# EAGLE design Adafruit Feather STM32F405 Express (EAGLE 9.5.0)
COMPANY: ADAFRUIT INDUSTRIES; DRAWN: KTOWN; REV: B
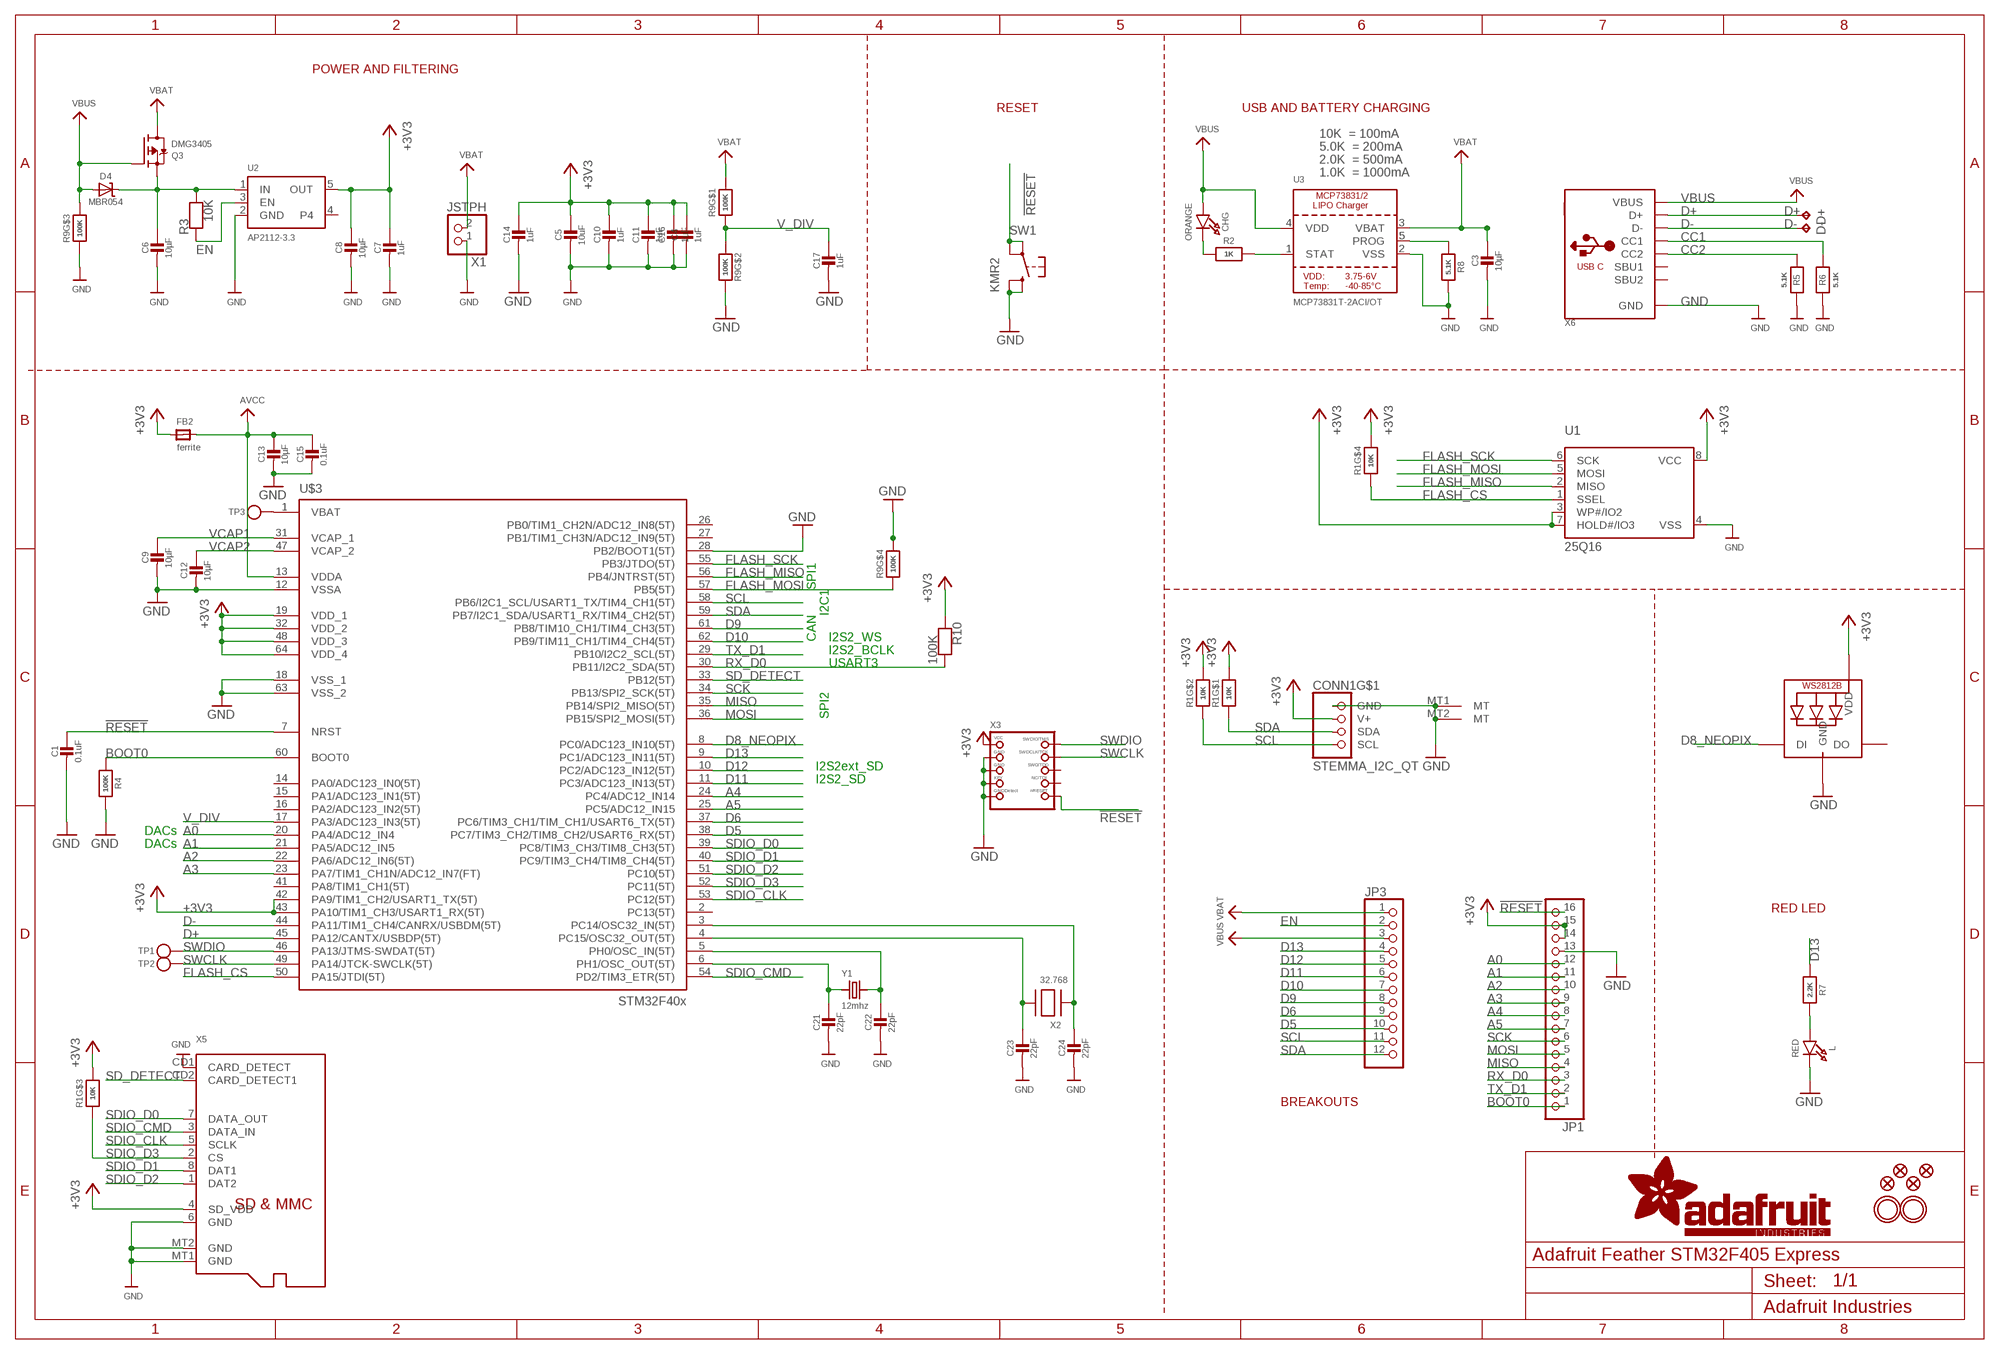
[diagram p0: schematic, sheet 1]

## Parts
C1  0.1uF  CAP_CERAMIC0603_NO  [0603-NO]
C2  22pF  CAP_4PACK1206  [RESPACK_4X0603]
C3  10µF  CAP_CERAMIC0805-NOOUTLINE  [0805-NO]
C4  1uF  CAP_CERAMIC0603_NO  [0603-NO]
C5  10uF  CAP_CERAMIC0805-NOOUTLINE  [0805-NO]
C6  10µF  CAP_CERAMIC0805-NOOUTLINE  [0805-NO]
C7  1uF  CAP_CERAMIC0603_NO  [0603-NO]
C8  10µF  CAP_CERAMIC0805-NOOUTLINE  [0805-NO]
C9  10µF  CAP_CERAMIC0805-NOOUTLINE  [0805-NO]
C10  1uF  CAP_CERAMIC0603_NO  [0603-NO]
C11  1uF  CAP_CERAMIC0603_NO  [0603-NO]
C12  10µF  CAP_CERAMIC0805-NOOUTLINE  [0805-NO]
C13  10µF  CAP_CERAMIC0805-NOOUTLINE  [0805-NO]
C14  1uF  CAP_CERAMIC0603_NO  [0603-NO]
C15  0.1uF  CAP_CERAMIC0603_NO  [0603-NO]
C16  1uF  CAP_CERAMIC0603_NO  [0603-NO]
C17  1uF  CAP_CERAMIC0603_NO  [0603-NO]
CHG  ORANGE  LED0805_NOOUTLINE  [CHIPLED_0805_NOOUTLINE]
CONN1  STEMMA_I2C_QT  [JST_SH4]
D4  MBR054  DIODE-SCHOTTKYSOD-123  [SOD-123]
D+  TPB1,27  [B1,27]
D-  TPB1,27  [B1,27]
FB2  ferrite  FERRITE-0805NO  [0805-NO]
JP1  HEADER-1X16ROUND  [1X16_ROUND]
JP3  HEADER-1X12  [1X12_ROUND]
L  RED  LED0805_NOOUTLINE  [CHIPLED_0805_NOOUTLINE]
LED1  WS2812B3535  [LED3535]
Q3  DMG3405  MOSFET-P  [SOT23-R]
R1  10K  RESISTOR_4PACK_NO  [RESPACK_4X0603_NO]
R2  1K  RESISTOR_0603_NOOUT  [0603-NO]
R3  10K  RESISTOR_0603_NOOUT  [0603-NO]
R4  100K  RESISTOR_0603_NOOUT  [0603-NO]
R5  5.1K  RESISTOR_0603_NOOUT  [0603-NO]
R6  5.1K  RESISTOR_0603_NOOUT  [0603-NO]
R7  2.2K  RESISTOR_0603_NOOUT  [0603-NO]
R8  5.1K  RESISTOR_0603_NOOUT  [0603-NO]
R9  100K  RESISTOR_4PACK_NO  [RESPACK_4X0603_NO]
R10  100K  RESISTOR_0603_NOOUT  [0603-NO]
SW1  KMR2  SWITCH_TACT_SMT4.6X2.8  [BTN_KMR2_4.6X2.8]
TP1  TESTPOINTROUND1.5MM  [TESTPOINT_ROUND_1.5MM]
TP2  TESTPOINTROUND1.5MM  [TESTPOINT_ROUND_1.5MM]
TP3  TESTPOINTROUND1.5MM  [TESTPOINT_ROUND_1.5MM]
U1  25Q16  SPIFLASH_8PIN  [SOIC8_150MIL]
U2  AP2112-3.3  VREG_SOT23-5  [SOT23-5]
U3  MCP73831T-2ACI/OT  MCP73831/2  [SOT23-5]
U$3  STM32F405R  [TQFP64]
U$5  FIDUCIAL_1MM  [FIDUCIAL_1MM]
U$31  MOUNTINGHOLE2.5  [MOUNTINGHOLE_2.5_PLATED]
U$32  MOUNTINGHOLE2.5  [MOUNTINGHOLE_2.5_PLATED]
U$34  FIDUCIAL_1MM  [FIDUCIAL_1MM]
U$35  FIDUCIAL_1MM  [FIDUCIAL_1MM]
U$37  FIDUCIAL_1MM  [FIDUCIAL_1MM]
X1  JSTPH  CON_JST_PH_2PIN  [JSTPH2]
X2  32.768  XTAL-3.2X1.5  [XTAL3215]
X3  JTAG-CORTEX  [2X05_1.27MM_SMT]
X5  MICROSD  [MICROSD]
X6  USB_C  [USB_C_CUSB31-CFM2AX-01-X]
Y1  12mhz  CRYSTAL2.5X2.0  [CRYSTAL_2.5X2]

## Nets
!RESET: C1.1 JP1.16 SW1.A'(P1) SW1.A(P) U$3.7(NRST) X3.10(NRESET)
+3V3 [power]: C4.1 C5.1 C7.1 C8.1 C10.1 C11.1 C14.1 C16.1 CONN1.2(V+) FB2.1 JP1.14 JP1.15 LED1.2(VDD) R1.5 R1.6 R1.7 R1.8 R10.1 U1.3(WP#/IO2) U1.7(HOLD#/IO3) U1.8(VCC) U2.5(OUT) U$3.19(VDD_1) U$3.32(VDD_2) U$3.42(PA9/TIM1_CH2/USART1_TX(5T)) U$3.43(PA10/TIM1_CH3/USART1_RX(5T)) U$3.48(VDD_3) U$3.64(VDD_4) X3.1(VCC) X5.4(SD_VDD)
A0: JP1.12 U$3.20(PA4/ADC12_IN4)
A1: JP1.11 U$3.21(PA5/ADC12_IN5)
A2: JP1.10 U$3.22(PA6/ADC12_IN6(5T))
A3: JP1.9 U$3.23(PA7/TIM1_CH1N/ADC12_IN7(FT))
A4: JP1.8 U$3.24(PC4/ADC12_IN14)
A5: JP1.7 U$3.25(PC5/ADC12_IN15)
AVCC: C13.1 C15.1 FB2.2 U$3.13(VDDA)
BATTERY: TP3.P$1 U$3.1(VBAT)
BOOT0: JP1.1 R4.1 U$3.60(BOOT0)
CC1: R6.2 X6.A5(CC1)
CC2: R5.2 X6.B5(CC2)
D5: JP3.10 U$3.38(PC7/TIM3_CH2/TIM8_CH2/USART6_RX(5T))
D6: JP3.9 U$3.37(PC6/TIM3_CH1/TIM_CH1/USART6_TX(5T))
D8_NEOPIX: LED1.1(DI) U$3.8(PC0/ADC123_IN10(5T))
D9: JP3.8 U$3.61(PB8/TIM10_CH1/TIM4_CH3(5T))
D10: JP3.7 U$3.62(PB9/TIM11_CH1/TIM4_CH4(5T))
D11: JP3.6 U$3.11(PC3/ADC123_IN13(5T))
D12: JP3.5 U$3.10(PC2/ADC123_IN12(5T))
D13: JP3.4 R7.1 U$3.9(PC1/ADC123_IN11(5T))
D+: D+.TP U$3.45(PA12/CANTX/USBDP(5T)) X6.A6(D+) X6.B6(D+)
D-: D-.TP U$3.44(PA11/TIM1_CH4/CANRX/USBDM(5T)) X6.A7(D-) X6.B7(D-)
EN: JP3.2 R3.1 U2.3(EN)
FLASH_CS: R1.4 U1.1(SSEL) U$3.50(PA15/JTDI(5T))
FLASH_MISO: U1.2(MISO) U$3.56(PB4/JNTRST(5T))
FLASH_MOSI: R9.4 U1.5(MOSI) U$3.57(PB5(5T))
FLASH_SCK: U1.6(SCK) U$3.55(PB3/JTDO(5T))
GND [gnd]: C1.2 C2.5 C2.6 C2.7 C2.8 C3.2 C4.2 C5.2 C6.2 C7.2 C8.2 C9.2 C10.2 C11.2 C12.2 C13.2 C14.2 C15.2 C16.2 C17.2 CONN1.1(GND) CONN1.MT1(MT) CONN1.MT2(MT) JP1.13 L.C LED1.4(GND) R4.2 R5.1 R6.1 R8.2 R9.3 R9.5 R9.7 SW1.B'(S1) SW1.B(S) U1.4(VSS) U2.2(GND) U3.2(VSS) U$3.12(VSSA) U$3.18(VSS_1) U$3.28(PB2/BOOT1(5T)) U$3.63(VSS_2) X1.1 X3.3(GND) X3.5(GND) X3.7(KEY) X3.9(GNDDETECT) X5.6(GND) X5.CD1(CARD_DETECT) X5.MT1(GND) X5.MT2(GND) X6.A1B12(GND) X6.B1A12(GND)
MISO: JP1.4 U$3.35(PB14/SPI2_MISO(5T))
MOSI: JP1.5 U$3.36(PB15/SPI2_MOSI(5T))
N$1: CHG.C R2.1
N$2: L.A R7.2
N$3: R2.2 U3.1(STAT)
N$4: R8.1 U3.5(PROG)
N$5: C2.4 U$3.3(PC14/OSC32_IN(5T)) X2.P$1
N$6: C2.2 U$3.5(PH0/OSC_IN(5T)) Y1.3
N$7: C2.3 U$3.4(PC15/OSC32_OUT(5T)) X2.P$2
N$8: C2.1 U$3.6(PH1/OSC_OUT(5T)) Y1.1
RX_D0: JP1.3 R10.2 U$3.30(PB11/I2C2_SDA(5T))
SCK: JP1.6 U$3.34(PB13/SPI2_SCK(5T))
SCL: CONN1.4(SCL) JP3.11 R1.2 U$3.58(PB6/I2C1_SCL/USART1_TX/TIM4_CH1(5T))
SD_DETECT: U$3.33(PB12(5T)) X5.CD2(CARD_DETECT1)
SDA: CONN1.3(SDA) JP3.12 R1.1 U$3.59(PB7/I2C1_SDA/USART1_RX/TIM4_CH2(5T))
SDIO_CLK: U$3.53(PC12(5T)) X5.5(SCLK)
SDIO_CMD: U$3.54(PD2/TIM3_ETR(5T)) X5.3(DATA_IN)
SDIO_D0: U$3.39(PC8/TIM3_CH3/TIM8_CH3(5T)) X5.7(DATA_OUT)
SDIO_D1: U$3.40(PC9/TIM3_CH4/TIM8_CH4(5T)) X5.8(DAT1)
SDIO_D2: U$3.51(PC10(5T)) X5.1(DAT2)
SDIO_D3: R1.3 U$3.52(PC11(5T)) X5.2(CS)
SWCLK: TP2.P$1 U$3.49(PA14/JTCK-SWCLK(5T)) X3.4(SWDCLK)
SWDIO: TP1.P$1 U$3.46(PA13/JTMS-SWDAT(5T)) X3.2(SWDIO)
TX_D1: JP1.2 U$3.29(PB10/I2C2_SCL(5T))
V_DIV: C17.1 R9.1 R9.2 U$3.17(PA3/ADC123_IN3(5T))
VBAT [power]: C3.1 JP3.1 Q3.3(D) R9.8 U3.3(VBAT) X1.2
VBUS [power]: CHG.A D4.A JP3.3 Q3.1(G) R9.6 U3.4(VDD) X6.A4B9(VBUS) X6.B4A9(VBUS)
VCAP1: C9.1 U$3.31(VCAP_1)
VCAP2: C12.1 U$3.47(VCAP_2)
VHI: C6.1 D4.C Q3.2(S) R3.2 U2.1(IN)
Unconnected: LED1.3(DO) U2.4 U$3.2(PC13(5T)) U$3.14(PA0/ADC123_IN0(5T)) U$3.15(PA1/ADC123_IN1(5T)) U$3.16(PA2/ADC123_IN2(5T)) U$3.26(PB0/TIM1_CH2N/ADC12_IN8(5T)) U$3.27(PB1/TIM1_CH3N/ADC12_IN9(5T)) U$3.41(PA8/TIM1_CH1(5T)) X3.6(SWO) X3.8(TDI) X6.A8(SBU1) X6.B8(SBU2)

## Notes on the sheet
- POWER AND FILTERING
- RESET | USB AND BATTERY CHARGING
- 10K  = 100mA
- 5.0K  = 200mA
- 2.0K  = 500mA
- 1.0K  = 1000mA
- SPI1
- I2C1
- CAN | I2S2_WS
- I2S2_BCLK
- USART3
- SPI2
- I2S2ext_SD
- I2S2_SD
- DACs
- DACs
- RED LED
- BREAKOUTS

## Library data of the parts
C1 C3-C7 C9-C17 = microbuilder:CAP_CERAMIC: Ceramic Capacitors For new designs, use the packages preceded by an '_' character since they are more reliable: The following footprints should be used on most boards: _0402 - Standard footprint for regular board layouts _0603 - Standard footprint for regular board layouts _0805 - Standard footprint for regular board layouts _1206 - Standard footprint for regular board layouts For extremely tight-pitch boards where space is at a premium, the following 'micro-pitch' footprints can be used (smaller pads, no silkscreen outline, etc.): _0402MP - Micro-pitch footprint for very dense/compact boards _0603MP - Micro-pitch footprint for very dense/compact boards _0805MP - Micro-pitch footprint for very dense/compact boards _1206MP - Micro-pitch footprint for very dense/compact boards
C2 = microbuilder:CAP_4PACK
C8 = microbuilder:CAP_CERAMIC: Ceramic Capacitors For new designs, use the packages preceded by an '_' character since they are more reliable: The following footprints should be used on most boards: _0402 - Standard footprint for regular board layouts _0603 - Standard footprint for regular board layouts _0805 - Standard footprint for regular board layouts _1206 - Standard footprint for regular board layouts For extremely tight-pitch boards where space is at a premium, the following 'micro-pitch' footprints can be used (smaller pads, no silkscreen outline, etc.): _0402MP - Micro-pitch footprint for very dense/compact boards _0603MP - Micro-pitch footprint for very dense/compact boards _0805MP - Micro-pitch footprint for very dense/compact boards _1206MP - Micro-pitch footprint for very dense/compact boards; REV: B
CHG L = microbuilder:LED: LED 0603 - 0603 Surface Mount Package 2mA: Green LED - Low Power (3.9mcd, 2ma, 1.7Vf) - Digikey: 475-2709-2-ND Orange LED - Low Power (9.8mcd, 2ma, 1.8Vf) - Digikey: 475-1194-2-ND Red LED - Low Power (5mcd, 2ma, 1.8Vf) - Digikey: 475-1195-2-ND Yellow LED - Low Power (7mcd, 2ma, 1.8Vf) - Digikey: 475-1196-2-ND 5mA: Blue LED - Low Power (17mcd, 5ma, 2.9Vf) - Digikey: LNJ937W8CRACT-ND 0805 - 0805 Surface Mount Package 2mA: Red LED (8.8mcd, 2mA, 1.8Vf, Clear) - Low Power [Digikey: 475-2510-1-ND] Green LED (5mcd, 2mA, 1.8Vf, Clear) - Low Power [Digikey: 475-2730-1-ND] Yellow LED (11.3mcd, 2mA, 1.8Vf, Clear) - Low Power [Digikey: 475-2555-1-ND] 20mA: Red LED (104mcd, 20mA, Diffused) - LS R976 [Digikey: 475-1278-6-ND] Red LED (12mcd, 20mA, 2.0Vf, Clear) - APT2012EC [Digikey: 754-1128-1-ND] Green LED (15mcd, 20mA, 2.2Vf, Clear) - APT2012GC [Digikey: 754-1131-1-ND] Orange LED (160mcd, 20mA, 2.1Vf, Clear) - APT2012SECK [Digikey: 754-1130-1-ND] 1206 - 1206 Surface Mount Package Green LED (26mcd, 20mA, Diffused) - LG N971 [Digikey: 475-1407-6-ND] Red LED (15mcd, 20mA, Diffused) - LH N974 [Digikey: 475-1416-6-ND] Cree - Cree High-Power Surface Mount LEDs XPEBWT-L1-0000-00D50 - White 111lm 350mA 2.9Vf 6200K 110° XTEAWT-00-0000-00000LEE3 - White 114lm 350mA 2.85Vf 5000K 115° Everlight - Everlight 45-21 Series Surface Mount LEDs 45-21/QK2C-B2832AC2CB2/2T - Warm White 2000mcd 20mA 3.25Vf 3050K 120° 45-21/LK2C-B38452C4CB2/2T - Nuetral White 2000mcd 20mA 3.25Vf 4150K 120° 45-21/LK2C-B50634C6CB2/2T - Cold White 2200mcd 20mA 3.25Vf 5650K 120° PLCC2 Reverse Mount LS T77K-J1L2-1-0-2-R18-Z - Red 11.25mcd 2mA 1.8Vf 630nm 120° LO T77K-L1M2-24-Z - Orange 19.6mcd 2mA 1.8Vf 606nm 120° LY T77K-K2M1-26-Z - Yellow 15.7mcd 2mA 1.8Vf 587nm 120°
CONN1 = microbuilder:STEMMA_I2C
D4 = microbuilder:DIODE-SCHOTTKY
D+ D- = testpad:TP: Test pad
FB2 = microbuilder:FERRITE: Ferrite Bead 0603 MMZ1608B121C - 120 Ohm @ 100MHz, 600mA, 0.15 Ohm DC Resistance - Digikey: 445-2164-1-ND BK1608HW121-T - 120 Ohm, 600mA Ferrite Chip - Digikey: 587-1876-2-ND 0805 HZ0805B272R-10 - 2.7K Ohm @ 100MHz, 200mA, 0.8 Ohm DC Resistance - Digikey: 240-2504-1-ND (see also Murata BLM21BD272SN1L) MMZ2012Y152B - 1.5K Ohm @ 100MHz, 500mA, 0.4 Ohm DC Resistance - Digikey: 445-1560-1-ND - Mainly for high frequency (80-400MHz) MMZ2012R102A - 1K Ohm @ 100MHz, 500mA, 0.3 Ohm DC Resistance - Digikey: 445-1555-2-ND - More general purpose (10-200MHz)
JP1 = microbuilder:HEADER-1X16: PIN HEADER
JP3 = microbuilder:HEADER-1X12
LED1 = microbuilder:WS2812B
Q3 = microbuilder:MOSFET-P: P-Channel Mosfet LEGEND VDS: Voltage Drain-Source ID: Drain Current RDS(ON): Drain-Source On-State Resistance VGS(TH): Gate-Source Threshold Voltage CISS: Drain-Source Input Capacitance SOT-23 Name VDS ID RDS(ON) VGS(TH) CISS Order Number IRLML5103 30V 760mA 600 mOhm -- 75pF @ 25V Digikey: IRLML5103PBFCT-ND IRLML6401 12V 4.3A 50 mOhm 950mV @ 250µA 830pF @ 10V Digikey: IRLML6401PBFTR-ND NTR0202PL 20V 400mA 800 mOhm 2.3V @ 250uA 70pF @ 5V Digikey: NTR0202PLT1GOSTR-ND NTR4101PT1G 20V 1.8A 85 mOhm 1.2V @ 250uA 675pF @ 10V Digikey: NTR4101PT1GOSCT-ND DMP2004K 20V 600mA 900 mOhm 1V @ 250uA 175pF @ 16V Digikey: DMP2004KDICT-ND PMV65XP 20V 3.9A 76 mOhm 950mV @ 1mA 725pF @ 20V Digikey: 568-2358-2-ND TO-252 Name VDS ID RDS(ON) VGS(TH) CISS Order Number AOD417 30V 25A 34 mOhm 3V @ 250µA 920pF @ 15V Digikey: 785-1106-2-ND PowerPak Name VDS ID RDS(ON) VGS(TH) CISS Order Number AON7401 30V 12A 14 mOhm 3V @ 250µA 2600pF @ 15V Digikey: 785-1302-1-ND
R1 R9 = microbuilder:RESISTOR_4PACK: Resistor Packs (4 resistors) 4 x 0603 10K 1/16W - Digikey: YC164J-10KCT-ND
R2-R8 R10 = microbuilder:RESISTOR: Resistors For new designs, use the packages preceded by an '_' character since they are more reliable: The following footprints should be used on most boards: _0402 - Standard footprint for regular board layouts _0603 - Standard footprint for regular board layouts _0805 - Standard footprint for regular board layouts _1206 - Standard footprint for regular board layouts For extremely tight-pitch boards where space is at a premium, the following 'micro-pitch' footprints can be used (smaller pads, no silkscreen outline, etc.): _0402MP - Micro-pitch footprint for very dense/compact boards _0603MP - Micro-pitch footprint for very dense/compact boards _0805MP - Micro-pitch footprint for very dense/compact boards _1206MP - Micro-pitch footprint for very dense/compact boards
SW1 = microbuilder:SWITCH_TACT_SMT: SMT Tact Switches 6x6mm - Digikey: P12940SCT-ND KMR2 (4.6x2.8mm) - Digikey: 401-1426-1-ND EVQ-PQHB55 - Light Touch, 160GF (4.5x4.5mm) - Digikey: P8090SCT-ND KMT0 - KMT021 NGJ LHS (etc.) IP68/Waterproof - Digikey: CKN10289CT-ND
TP1-TP3 = microbuilder:TESTPOINT: Test Point Various test points for characterisation and PCB testing TESTPOINT_SMT - Compact Surface Mount Test Point [Digikey: 5016KTR-ND]
U1 = microbuilder:SPIFLASH_8PIN: SOIC8 SPI Flash Be careful with the size since SOIC8 flash comes in several 'widths' SOIC8 150 mil M25P16 - 16Mbit (2Mbit x 8) Serial Flash (75MHz SPI Bus), Supply: 2.7-3.6V Digikey: SOIC8 - M25P16-VMN6P-ND SOIC8 208 mil W25Q16BVSSIG - 16Mbit (2Mbit x 8) Serial Flash (104MHz SPI Bus), Supply: 2.7-3.6V Digikey: SOIC8 - W25Q16BVSSIG-ND
U2 = microbuilder:VREG_SOT23-5: SOT23-5 Fixed Voltage Regulators Part Current Out V Out V In V Dropout θJA (°C/W) TJ (°C) Digikey Part No. ADP121 150mA 3.3V 3.4-5.5V 0.09V @ 150mA -- -- ADP121-AUJZ33R7CT-ND ADP121 150mA 3.0V 3.1-5.5V 0.09V @ 150mA -- -- ADP121-AUJZ30R7CT-ND ADP122 300mA 3.3V 3.4-5.5V 0.085V @ 300mA -- -- ADP122AUJZ-3.3-R7CT-ND ADP1712 300mA 3.3V 3.5-5.5V 0.17V @ 300mA -- -- ADP1712AUJZ-3.3-R7TR-ND AP7311 (Low Cost) 150mA 3.3V 3.5-6V 0.15V @ 150mA -- -- AP7311-33WG-7DICT-ND LD39015M18R 150mA 1.8V 1.9V-5.5V 0.08V @ 100mA -- -- 497-6977-1-ND LP2985A-33DBVR 150mA 3.3V 3.3-16V 0.28V @ 150mA 206 150 296-18479-1-ND MCP1824T-3302E/OT 300mA 3.3V 3.5V-6V 0.2V @ 300mA -- -- MCP1824T-3302E/OTCT-ND MIC5205-2.5YM5 TR 150mA 2.5V 2.7-16V 0.165V @ 150mA -- -- 576-1257-2-ND MIC5205-3.0YM5 TR 150mA 3.0V 3.2V-16V 0.165V @ 150mA -- -- 576-1258-2-ND MIC5205-3.3YM5 TR 150mA 3.3V 3.5V-16V 0.165V @ 150mA -- -- 576-1259-2-ND TPS780330220 150mA 3.3V+2.2V 3.6-5.5V 250mV Max -- -- 296-23332-1-ND TDA3663/N1,135 100mA 3.3V 3.5-45V 0.18V @ 50mA -- -- 568-5343-1-ND Max operating temp can be calculated using θJA, TJ (max junction temperature), and power in watts. Set the "Maximum Ambient Temperature" until it reaches TJ ("Max Junction Temperature"), which is the absolute limit for safe use of the regulator: Heat Sink Temperature Calculator <http://www.daycounter.com/Calculators/Heat-Sink-Temperature-Calculator.phtml> For example, With 12V source into a 3.3V LP2985 and a 30mA load, we are dissipating (12V-3.3V) * 0.03A = 0.261W. With a θJA of 206 °C/W, a TJ of 150°C, and 261mW we can safely use the chip without a heat sink up to 75°C (=147.1°C Junction Temperature).
U3 = microbuilder:MCP73831/2: MCP73831/2 LIPO Charger VDD: 3.75 - 6V Temp -40 - 85°C Programmable Charge Rate: 15-500mA NOTE: STAT is a tri-state logic output on the MCP73831 and an open-drain output on the MCP73832. SOT23-5 with 4.2V output and tri-state logic on STAT = MCP73831T-2ACI/OT
U$3 = adafruit_micro:STM32F405R: STM32F405 64 pin LQFP reviewed: YES tested: YES
U$5 U$34 U$35 U$37 = microbuilder:FIDUCIAL: Fiducial Alignment Points Various fiducial points for machine vision alignment.; BOM: EXCLUDE
U$31 U$32 = microbuilder:MOUNTINGHOLE: Mounting Hole For #2 screws (0.086"/2.18mm width, 0.094"/2.4mm hole) use 2.5mm; BOM: EXCLUDE
X1 = microbuilder:CON_JST_PH_2PIN: JST 2-Pin Right-Angle Connector PH-Series - 4UConnector: 17311 SH-Series - 4UConnector: 07278
X2 = adafruit2:XTAL: Low cost SMT crystals, no capacitors included http://www.ladyada.net/library/eagle
X3 = microbuilder:JTAG-CORTEX: Serial Wire (SW-DP) Connector Standard 0.05" 10-pin connector is for use with the Cortex M and Cortex A SWD (serial wire debugger) interface (SW-DP) Connectors 2x05_1.27MM_SMT - Inexpensive surface-mount header with bare pins, compatible with standard 10-pin SWD cables (4UCON: 16846) 2x05_1.27MM_BOX_NOPOSTS - Polarised surface-mount box (4UCON with caps: 19735, without caps: 15117 2x05_1.27MM_BOX_POSTS - Polarised surface-mount box with mounting holes (4UCON: 20317) Pinout: http://infocenter.arm.com/help/topic/com.arm.doc.faqs/attached/13634/cortex_debug_connectors.pdf http://www.keil.com/peripherals/coresight/connectors.asp
X5 = microbuilder:MICROSD: MicroSD/Transflash Card Holder with SPI pinout 3M: 2908-05WB-MG 4UConnector: 19656 Footprint courtesy: Adafruit Industries
X6 = microbuilder:USB_C: USB Type-C USB 2.0 Connector
Y1 = microbuilder:CRYSTAL: Crystals HC49UP - Surface Mount Crystal 4.0MHz 18pF +/-30ppm Surface Mount Crystal [Digikey: 535-9857-1-ND] 12.0 MHz Surface Mount Crystal [Digikey: 535-9869-6-ND] 25.0 MHz Surface Mount Crystal [Digikey: 535-9078-1-ND] 2.5 x 2.0mm - MEMs SMT Crystal 16.0 MHz 10pF 20ppm 2.5 x 2.0mm Crystal [Digikey -40-85°C: 535-10923-1-ND] 3.2 x 2.5mm - MEMs SMT Crystal 12.0 MHz 8pF 15ppm 3.2 x 2.5mm Crystal [Digikey: -10-70°C: 644-1047-1-ND -40-125°C: 644-1128-1-ND] 40~85°C cheaper: 644-1173-6-ND 16.0 MHz 8pF 15ppm 3.2 x 2.5mm Crystal [Digikey: -10-70°C: 644-1049-1-ND -40-125°C: 644-1129-2-ND]-40~85°C cheaper: 644-1175-6-ND 16.0 MHz 10pF 10ppm 3.2 x 2.5mm Crystal [Digikey: 644-1100-1-ND] 27.12 MHz 18pF 30ppm 3.2 x 2.5mm Crystal [Digikey: 887-1424-1-ND] 27.12MHz 10pF 10ppm 3.2 x 2.5mm Crystal [Digikey: 887-1329-1-ND] 4.9 x 1.8mm - MEMs SMT Crystal 32.768 KHz 12.5pF 20ppm 4.9 x 1.8mm Crystal [Digikey: SE2415CT-ND] 8.0 x 3.8mm - Surface Mount Crystal 32.768kHz 12.5pF 20ppm -40°C-85°C [Digikey: 535-9166-2-ND] Cylinder 32.768KHz Cylinder Crystal (2x6mm body) [Ex. Digikey: 300-8341-2-ND]

## Net classes
1 power: width 0.305 mm
2 gnd: width 0.254 mm

## Board
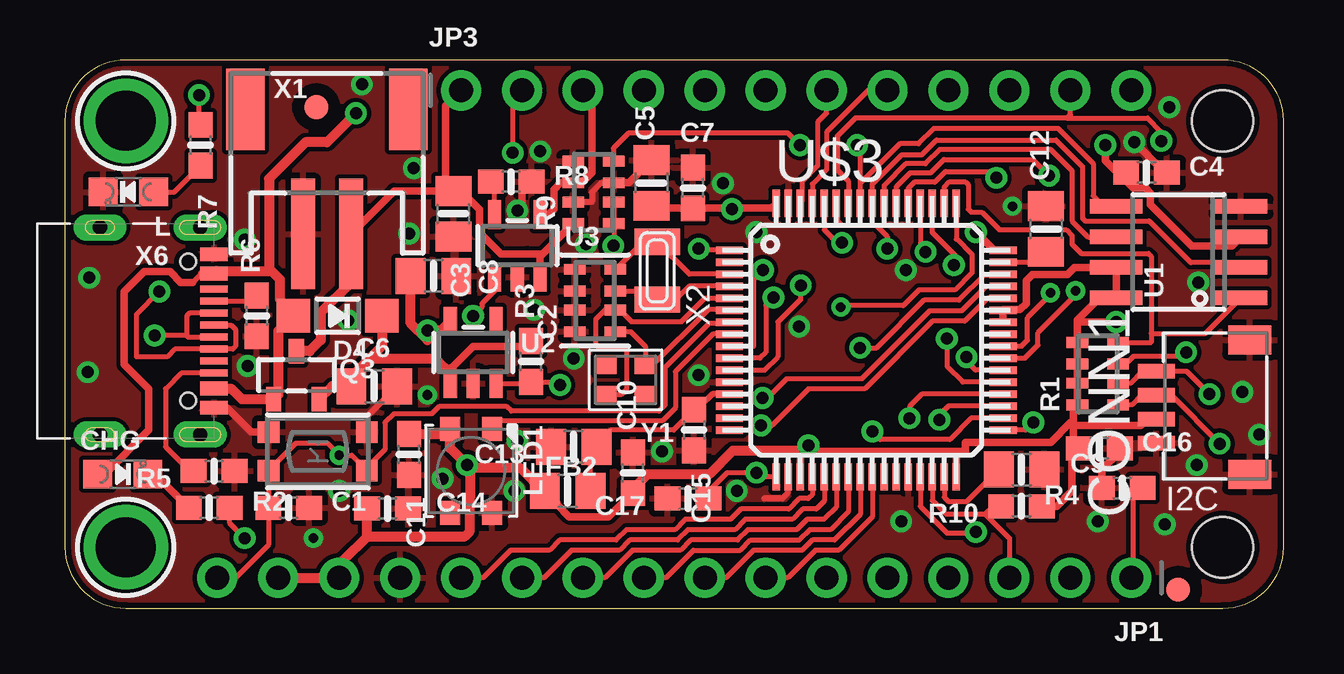
[diagram p1: board, top side]
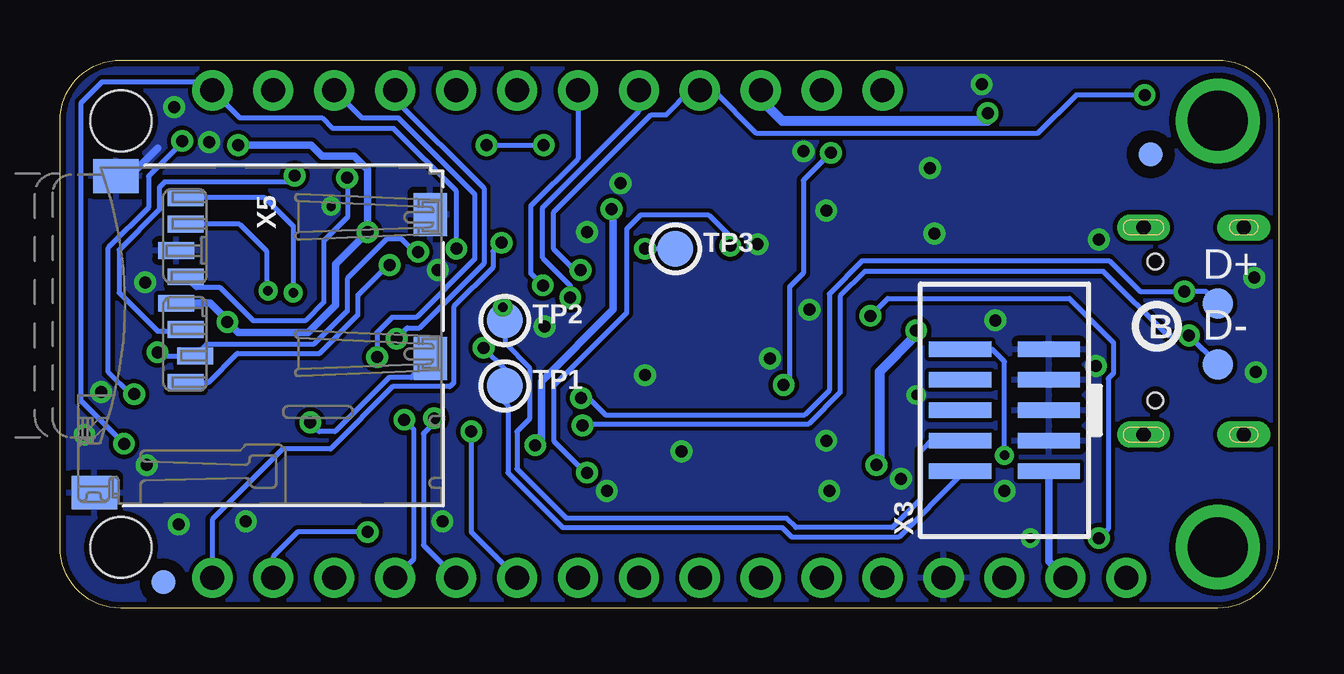
[diagram p2: board, bottom side, seen from below]

Size 50.8 x 22.86 mm. Coordinates in mm from the lower left corner, seen from the top.
Outline: 2.54,0 48.26,0 arc90 50.8,2.54 50.8,20.32 arc90 48.26,22.86 2.54,22.86 arc90 0,20.32 0,2.54 arc90 2.54,0
Copper layers (1*16): Top 0.035mm / dielectric 1.5mm / Bottom 0.035mm
Design rules "adafruit *": minimum track width 8mil, minimum drill 15.5mil, track to track 7mil, track to pad 7mil, pad to pad 7mil, via to via 7mil, smd to smd 7mil, copper to edge 10mil, drill to drill 8mil, minimum pad ring 10mil, minimum via ring 8mil, stop-mask expansion 2mil, vias tented up to drill 20mil, thermal gap 10mil
Holes 2.54 mm at 48.26,20.32 48.26,2.54

### Footprints (pad centres in the part's own frame; a part is rotated, then mirrored left to right if it is on the bottom)
0603-NO = smd 1.075 x 1: 1 -0.85,0; 2 0.85,0
RESPACK_4X0603 = smd 0.45 x 0.9: 1 -1.3,-0.85; 2 -0.4,-0.85; 3 0.4,-0.85; 4 1.3,-0.85; 5 1.3,0.85; 6 0.4,0.85; 7 -0.4,0.85; 8 -1.3,0.85
0805-NO = smd 1.24 x 1.5: 1 -0.95,0; 2 0.95,0
CHIPLED_0805_NOOUTLINE = smd 1.2 x 1.2: A 0,-1.05; C 0,1.05
JST_SH4 = smd 0.6 x 1.55: 1 -1.5,2.514; 2 -0.5,2.514; 3 0.5,2.514; 4 1.5,2.514 | smd 1.2 x 1.8: MT1 -2.8,-1.386; MT2 2.8,-1.386
SOD-123 = smd 1.4 x 1.4: A 1.85,0; C -1.85,0
B1,27 = smd 1.27 x 1.27: TP 0,0
1X16_ROUND = drill 1 pad 1.676: 1 -19.05,0; 2 -16.51,0; 3 -13.97,0; 4 -11.43,0; 5 -8.89,0; 6 -6.35,0; 7 -3.81,0; 8 -1.27,0; 9 1.27,0; 10 3.81,0; 11 6.35,0; 12 8.89,0; 13 11.43,0; 14 13.97,0; 15 16.51,0; 16 19.05,0
1X12_ROUND = drill 1 pad 1.676: 1 -13.97,0; 2 -11.43,0; 3 -8.89,0; 4 -6.35,0; 5 -3.81,0; 6 -1.27,0; 7 1.27,0; 8 3.81,0; 9 6.35,0; 10 8.89,0; 11 11.43,0; 12 13.97,0
LED3535 = smd 1 x 0.85: 1 -1.75,0.875; 2 -1.75,-0.875; 3 1.75,-0.875; 4 1.75,0.875
SOT23-R = smd 0.635 x 1.016: 1 -0.95,-1; 2 0.95,-1; 3 0,1
RESPACK_4X0603_NO = smd 0.45 x 0.9: 1 -1.3,-0.85; 2 -0.4,-0.85; 3 0.4,-0.85; 4 1.3,-0.85; 5 1.3,0.85; 6 0.4,0.85; 7 -0.4,0.85; 8 -1.3,0.85
BTN_KMR2_4.6X2.8 = smd 0.9 x 0.9: A 2.05,0.8; A' -2.05,0.8; B 2.05,-0.8; B' -2.05,-0.8
TESTPOINT_ROUND_1.5MM = smd 1.5 x 1.5: P$1 0,0
SOIC8_150MIL = smd 0.6 x 2.2: 1 -1.905,-2.6; 2 -0.635,-2.6; 3 0.635,-2.6; 4 1.905,-2.6; 5 1.905,2.6; 6 0.635,2.6; 7 -0.635,2.6; 8 -1.905,2.6
SOT23-5 = smd 0.55 x 1.2: 1 -0.95,-1.3; 2 0,-1.3; 3 0.95,-1.3; 4 0.95,1.3; 5 -0.95,1.3
TQFP64 = smd 1.143 x 0.305: 1 -5.7,3.75; 2 -5.7,3.25; 3 -5.7,2.75; 4 -5.7,2.25; 5 -5.7,1.75; 6 -5.7,1.25; 7 -5.7,0.75; 8 -5.7,0.25; 9 -5.7,-0.25; 10 -5.7,-0.75; 11 -5.7,-1.25; 12 -5.7,-1.75; 13 -5.7,-2.25; 14 -5.7,-2.75; 15 -5.7,-3.25; 16 -5.7,-3.75; 33 5.7,-3.75; 34 5.7,-3.25; 35 5.7,-2.75; 36 5.7,-2.25; 37 5.7,-1.75; 38 5.7,-1.25; 39 5.7,-0.75; 40 5.7,-0.25; 41 5.7,0.25; 42 5.7,0.75; 43 5.7,1.25; 44 5.7,1.75; 45 5.7,2.25; 46 5.7,2.75; 47 5.7,3.25; 48 5.7,3.75 | smd 0.305 x 1.143: 17 -3.75,-5.7; 18 -3.25,-5.7; 19 -2.75,-5.7; 20 -2.25,-5.7; 21 -1.75,-5.7; 22 -1.25,-5.7; 23 -0.75,-5.7; 24 -0.25,-5.7; 25 0.25,-5.7; 26 0.75,-5.7; 27 1.25,-5.7; 28 1.75,-5.7; 29 2.25,-5.7; 30 2.75,-5.7; 31 3.25,-5.7; 32 3.75,-5.7; 49 3.75,5.7; 50 3.25,5.7; 51 2.75,5.7; 52 2.25,5.7; 53 1.75,5.7; 54 1.25,5.7; 55 0.75,5.7; 56 0.25,5.7; 57 -0.25,5.7; 58 -0.75,5.7; 59 -1.25,5.7; 60 -1.75,5.7; 61 -2.25,5.7; 62 -2.75,5.7; 63 -3.25,5.7; 64 -3.75,5.7
FIDUCIAL_1MM = smd 1 x 1: 1 0,0
MOUNTINGHOLE_2.5_PLATED = drill 2.5 pad 3.2: P$1 0,0
JSTPH2 = smd 1 x 4.6: 1 -1,-3.7; 2 1,-3.7 | smd 1.6 x 3.4: NC1 -3.4,1.5; NC2 3.4,1.5
XTAL3215 = smd 1.1 x 1.9: P$1 1.2,0; P$2 -1.2,0
2X05_1.27MM_SMT = smd 0.65 x 2.6: 1 -2.54,-1.85; 2 -2.54,1.85; 3 -1.27,-1.85; 4 -1.27,1.85; 5 0,-1.85; 6 0,1.85; 7 1.27,-1.85; 8 1.27,1.85; 9 2.54,-1.85; 10 2.54,1.85
MICROSD = smd 0.7 x 1.5: 1 9,-10.64; 2 7.9,-10.24; 3 6.8,-10.64; 4 5.7,-11.04; 5 4.6,-10.64; 6 3.5,-11.04; 7 2.4,-10.64; 8 1.3,-10.64 | smd 1.8 x 1.4: CD1 2,-0.44; CD2 8,-0.44 | smd 1.4 x 1.9: MT1 0.4,-13.54; MT2 13.6,-14.44
USB_C_CUSB31-CFM2AX-01-X = smd 0.575 x 1.15: A1B12 -3.2,3.545; A4B9 -2.4,3.545; B1A12 3.2,3.545; B4A9 2.4,3.545 | smd 0.275 x 1.15: A5 -1.25,3.545; A6 -0.25,3.545; A7 0.25,3.545; A8 1.25,3.545; B5 1.75,3.545; B6 0.75,3.545; B7 -0.75,3.545; B8 -1.75,3.545 | drill 0.6 pad 1 long: M1 -4.32,2.97; M2 4.32,2.97; M3 -4.32,-1.21; M4 4.32,-1.21 | hole 0.65: 2.89,2.47; -2.89,2.47
CRYSTAL_2.5X2 = smd 0.9 x 0.75: 1 -0.825,-0.625; 2 0.825,-0.625; 3 0.825,0.625; 4 -0.825,0.625

### Placement (x,y rotation side)
C1  9.33,4.19 0 top
C2  22.1,12.83 90 top
C3  16.19,16.45 270 top
C4  45.09,18.16 0 top
C5  24.45,17.73 90 top
C6  12.9,9.25 0 top
C7  26.18,17.53 90 top
C8  15.36,13.86 0 top
C9  39.88,5.78 0 top
C10  23.68,5.64 90 top
C11  14.34,6.41 270 top
C12  40.89,15.81 90 top
C13  21.21,6.73 180 top
C14  13.45,4.15 0 top
C15  26.23,7.43 270 top
C16  43.12,6.67 0 top
C17  25.97,4.57 180 top
CHG  2.41,5.59 270 top
CONN1  48.01,8.38 90 top
D4  11.37,12.19 180 top
D+  2.54,12.7 0 bottom
D-  2.54,10.16 0 bottom
FB2  20.95,4.89 0 top
JP1  25.4,1.27 180 top
JP3  30.48,21.59 0 top
L  2.65,17.36 90 top
LED1  16.93,5.73 270 top
Q3  9.65,9.72 0 top
R1  43.05,9.78 90 top
R2  6.02,4.19 0 top
R3  19.43,10.29 90 top
R4  44.07,5.02 180 top
R5  6.22,5.71 180 top
R6  8,12.19 90 top
R7  5.65,19.3 270 top
R8  18.61,17.78 0 top
R9  22.03,17.34 90 top
R10  39.88,4.25 180 top
SW1  10.54,6.54 180 top
TP1  32.26,9.27 0 bottom
TP2  32.26,12 0 bottom
TP3  25.15,14.99 0 bottom
U1  46.42,14.85 90 top
U2  17.02,10.67 0 top
U3  18.86,15.11 0 top
U$3  33.4,11.18 0 top
U$5  5.33,18.92 0 bottom
U$13  [PCBFEAT-REV-040]  5.08,11.75 0 bottom
U$24  [FEATHER_STM32F405_TOP]  0,0 0 top
U$31  2.54,20.32 270 top
U$32  2.54,2.54 270 top
U$34  10.48,20.89 270 top
U$35  46.4,0.77 270 top
U$37  46.48,1.08 0 bottom
U$40  [FEATHER_STM32F405_BOT]  50.8,0 0 bottom
X1  10.92,19.3 0 top
X2  24.69,14.07 90 top
X3  11.43,8.26 90 bottom
X5  34.92,18.41 270 bottom
X6  2.67,11.56 270 top
Y1  23.37,9.53 180 top

### Tracks (layer width: path | path; a pad name or v marks a point on that pad's centre or on a via)
!RESET  (via drill 0.39)
  Top 0.203: JP1.16 7.11,1.27 8.48,2.64 C1.1 SW1.A 9.63,6.88 10.92,6.88 v11.43,6.38 11.96,6.38 SW1.A' 12.59,5.87 13.35,6.63 13.35,7.74 13.71,8.11 15.29,8.11 15.6,8.41 18.42,8.41 18.61,8.22 24.77,8.22 25.01,8.46 25.01,10.04 26.85,11.88 27.66,11.88 U$3.7
  Bottom 0.203: X3.10 11.94,10.79 11.43,10.29 v11.43,6.38
+3V3  (via drill 0.5)
  Top 0.305: 42.04,7.62 41.92,7.74 41.1,6.92 37.53,6.92 37.53,6.54 37.15,6.54 | 42.04,7.62 42.04,8.31 R1.8 R1.7 R1.6 R1.5 | CONN1.2 45.11,7.88 44.85,7.62 42.04,7.62 | v43.82,11.94 42.2,11.94 R1.5 | C5.1 24.55,16.68 C7.1 27.77,16.68 | U$3.19 30.65,6.54 30.73,6.54 v30.99,6.79 | U$3.32 37.15,6.54 | 37.15,6.54 31.24,6.54 v30.99,6.79 | U$3.48 38.73,14.93 v37.97,15.68 | U1.3 48.64,15.1 46.98,15.1 45.25,16.83 45.25,17.32 45.05,17.51 44.53,17.51 43.91,18.13 | R1.5 42.2,12.02 43.13,12.94 U1.8 U1.7 42.08,14.21 41.78,13.91 40.33,13.91 40.07,13.65 40.07,12.7 39.81,12.44 39.12,12.44 U$3.43 U$3.42 | v15.11,11.57 15.11,11.18 | v43.37,19.3 43.37,18.67 43.91,18.13 | 30.75,6.56 v30.99,6.79 | 27.77,16.68 v27.81,16.64 | U$3.64 29.45,16.68 27.77,16.68 | 23.49,4.99 23.33,4.99 23.33,4.48 22.66,3.81 21.02,3.81 20.51,4.32 20.51,4.38 FB2.1 19.97,4.86 | C4.1 44.2,18.13 43.91,18.13 | 42.04,7.62 42.04,6.9 C16.1 41.97,6.38 41.97,4.89 41.34,4.25 R10.1
  Top 0.406: U2.5 15.69,11.59 15.1,11.59 v15.11,11.57 | C8.1 14.41,11.88 15.11,11.18 | C11.1 15.84,7.26 LED1.2 16.05,6.68 v16.76,5.97 16.89,5.84 | 16.89,5.84 18.99,5.84 19.97,4.86 | 30.75,6.56 27.83,6.56 26.86,5.59 24.28,5.59 23.68,4.98 C10.1 23.49,4.99 | 16.89,5.84 16.89,4.66 16.86,4.62 16.86,3.19 16.65,2.98 12.6,2.98 | 12.6,2.98 C14.1 | JP1.15 JP1.14 11.58,1.27 11.58,1.97 12.6,2.98
  Bottom 0.305: X5.4 44.54,12.71 43.79,11.97 v43.82,11.94 43.38,11.49 40.45,11.49 39.31,12.64 39.31,14.35 v37.97,15.68 37.97,18.29 38.54,18.86 39.88,18.86 40.32,19.3 v43.37,19.3 | v30.99,6.79 30.73,7.05 30.73,9.46 27.75,12.45 27.75,16.57 v27.81,16.64 | X3.1 9.58,1.96 JP1.15
  Bottom 0.406: v16.76,5.97 16.64,6.1 16.64,9.86 15.11,11.38 v15.11,11.57
A0
  Top 0.203: U$3.20 31.15,4.74 30.99,4.57 30.61,4.57 30.18,4.14 28.18,4.14 27.75,3.71 25.86,3.71 25.42,3.28 23.41,3.28 22.97,2.85 20.62,2.85 20.19,2.41 18.58,2.41 17.43,1.27 JP1.12
A1
  Top 0.203: U$3.21 31.65,4.47 31.32,4.14 30.75,4.14 30.32,3.71 28.36,3.71 27.92,3.28 25.97,3.28 25.54,2.85 23.54,2.85 23.11,2.41 21.12,2.41 19.97,1.27 JP1.11
A2
  Top 0.203: U$3.22 32.15,4.21 31.65,3.71 30.93,3.71 30.5,3.28 28.47,3.28 28.04,2.85 26.09,2.85 25.65,2.41 23.66,2.41 22.51,1.27 JP1.10
A3
  Top 0.203: U$3.23 32.65,4.03 31.9,3.28 31.05,3.28 30.61,2.85 28.59,2.85 28.16,2.41 26.2,2.41 25.05,1.27 JP1.9
A4
  Top 0.203: U$3.24 33.15,3.92 32.08,2.85 31.16,2.85 30.73,2.41 28.7,2.41 27.56,1.27 JP1.8
A5
  Top 0.203: U$3.25 33.65,3.81 32.26,2.41 31.28,2.41 30.13,1.27 JP1.7
AVCC
  Top 0.203: 26.77,8.71 26.34,8.28 C15.1 25.38,7.43 22.73,7.43 22.16,6.86 C13.1 21.91,6.48 FB2.2
  Top 0.254: U$3.13 26.98,8.93 26.77,8.71
BATTERY  (via drill 0.5)
  Top 0.203: U$3.1 26.48,14.93 v26.42,14.99
  Bottom 0.203: v26.42,14.99 TP3.P$1
BOOT0  (via drill 0.5)
  Top 0.203: U$3.60 31.65,15.78 32.19,15.24 v32.4,15.24 | JP1.1 44.51,1.33 44.51,4.61 R4.1
  Bottom 0.203: v32.4,15.24 32.75,14.89 32.75,14.21 34.39,12.57 34.39,9.4 34.55,9.24 36.93,9.24 39.53,6.64 41.52,6.64 44.45,3.7 JP1.1
CC1
  Top 0.203: X6.A5 7.77,12.81 R6.2
CC2
  Top 0.203: X6.B5 4.85,9.81 4.19,9.14 4.19,6.73 5.21,5.71 R5.2
D5  (via drill 0.5)
  Top 0.203: U$3.38 37.96,9.93 37.58,10.3 v37.58,10.47
  Bottom 0.203: JP3.10 38.23,20.45 36.7,20.45 33.52,17.26 33.52,14.55 35.94,12.13 36.96,12.13 37.58,11.5 v37.58,10.47
D6  (via drill 0.5)
  Top 0.203: U$3.37 37.42,9.43 36.77,10.08 v36.77,11.24
  Bottom 0.203: JP3.9 36.83,21.21 33.13,17.51 33.13,14.37 35.81,11.68 36.32,11.68 v36.77,11.24
D8_NEOPIX
  Top 0.203: LED1.1 18.14,7.81 24.91,7.81 25.44,8.35 25.44,9.86 27.01,11.43 U$3.8
D9
  Top 0.203: JP3.8 33.49,21.59 31.75,19.85 31.75,18.29 31.15,17.69 U$3.61
D10
  Top 0.203: JP3.7 31.75,20.64 31.37,20.26 31.37,18.45 30.72,17.8 30.72,16.94 U$3.62
D11  (via drill 0.5)
  Top 0.203: U$3.11 29.17,9.93 29.72,10.48 29.72,11.94 30.67,12.89 v30.67,13.46
  Bottom 0.203: v30.67,13.46 31.18,13.97 31.18,16.76 29.21,18.73 JP3.6
D12  (via drill 0.5)
  Top 0.203: U$3.10 28.98,10.43 29.21,10.66 29.21,12.63 v29.53,12.95
  Bottom 0.203: v29.53,12.95 29.53,13.46 30.68,14.61 30.68,16.71 26.67,20.73 JP3.5
D13  (via drill 0.5)
  Top 0.203: U$3.9 28.71,10.93 28.71,13.71 v29.1,14.1 | R7.1 5.59,20.22 v5.59,21.4
  Bottom 0.203: v29.1,14.1 29.35,14.1 30.23,14.97 30.23,16.51 26.16,20.57 25.53,20.57 24.51,21.59 JP3.4 23.57,21.59 21.79,19.81 10.03,19.81 8.45,21.4 v5.59,21.4
D+  (via drill 0.5)
  Top 0.203: U$3.45 38.4,13.43 37.38,12.4 36.05,12.4 33.22,9.58 30.1,9.58 29.29,8.76 v29.08,8.76 | X6.A6 6.93,11.81 7.11,11.62 7.11,10.92 7,10.81 X6.B6 4.58,10.81 4.25,10.48 2.98,10.48 2.98,12.26 v3.94,13.21
  Bottom 0.203: v29.08,8.76 28.77,8.76 28.07,8.06 19.75,8.06 18.73,9.08 18.73,13.11 17.35,14.49 7.06,14.49 5.78,13.21 v3.94,13.21 3.05,13.21 D+.TP
D-  (via drill 0.5)
  Top 0.203: U$3.44 38.47,12.93 37.51,11.97 36.17,11.97 33.34,9.14 30.99,9.14 29.46,7.62 v29.02,7.62 | X6.B7 5.2,12.31 5.08,12.19 5.08,11.37 | 5.08,11.37 5.14,11.31 X6.A7 | 5.08,11.37 v3.75,11.37 v3.74,11.37
  Bottom 0.203: v29.02,7.62 28.96,7.68 19.59,7.68 18.29,8.99 18.29,13.01 17.25,14.05 7.3,14.05 4.63,11.37 v3.74,11.37 2.54,10.17 D-.TP
EN  (via drill 0.5)
  Top 0.203: U2.3 19.36,9.37 R3.1 20.51,9.44 v20.64,9.3 | JP3.2 18.67,21.21 v18.67,18.99
  Bottom 0.203: v20.64,9.3 20.38,9.56 20.38,13.4 19.81,13.97 19.81,17.84 v18.67,18.99
FLASH_CS
  Top 0.203: R1.4 45.28,11.08 45.28,11.46 | 45.28,11.46 47.54,11.46 U1.1 | U$3.50 36.65,17.56 36.87,17.78 37.53,17.78 37.66,17.65 37.66,16.64 37.78,16.51 38.22,16.51 38.94,15.79 41.73,15.79 41.97,15.55 41.97,15.18 42.36,14.79 45.16,14.79 45.28,14.68 45.28,11.46
FLASH_MISO
  Top 0.203: U1.2 48.83,14.4 46.94,14.4 45.19,16.15 42.53,16.15 42.41,16.26 42.41,18.42 41.31,19.52 36.33,19.52 35.72,18.91 34.88,18.91 33.65,17.68 U$3.56
FLASH_MOSI  (via drill 0.5)
  Top 0.203: U1.5 43.31,16.75 42.87,17.2 42.87,18.54 41.4,20 36.22,20 35.58,19.37 34.8,19.37 33.15,17.72 | U$3.57 33.15,17.72 | 33.15,17.72 33.15,19.17 v33.02,19.3 | v30.64,19.3 30.13,19.81 23.5,19.81 22.86,19.18 22.86,18.66 R9.4
  Bottom 0.203: v33.02,19.3 v30.64,19.3
FLASH_SCK
  Top 0.203: U$3.55 34.15,17.64 35.04,18.53 35.88,18.53 36.49,19.14 41.08,19.14 41.98,18.24 41.98,16.15 42.65,15.48 U1.6
GND  (via drill 0.39, 0.4, 0.5)
  Top 0.254: C6.2 12.59,7.99 SW1.B' | R9.3 22.37,17.73 21.97,17.34 21.97,16.95 21.95,16.94 R9.7 | U$3.18 30.11,5.43 30.11,4.78 29.9,4.57 29.15,4.57
  Top 0.305: R9.3 23.5,17.73 C5.2 | R8.2 19.05,17.38 19.05,16.76 v18.86,16.57 | v44.58,19.43 45.85,18.16 C4.2 | C16.2 43.97,6.53 43.22,5.78 R4.2 | X6.B1A12 6.76,8.36 7.77,7.34 SW1.B
  Bottom 0.305: X5.MT1 47.9,18.02 46.74,19.18
  other vias: 28.83,15.68 27.43,17.72 21.21,10.41 14.35,15.62 11.81,12 15.75,5.4 18.86,6.99 18.73,4.89 26.42,9.72 7.62,10.1 7.49,15.37 39.5,16.76 47.18,5.97 43.05,3.62 49.09,9.02 15.11,8.89 24.89,6.54 47.24,13.59 49.78,7.24 45.85,3.49 30.61,11.75 35.05,14.1 46.04,20.89 19.81,19.05 14.54,18.35 28,4.89 34.86,3.62 10.35,2.92 19.56,12.45 11.43,4.89 21.72,15.18 1.02,13.78 0.95,9.84 12.38,21.84
  pour Top: 0,22.86 50.8,22.86 50.8,0 0,0
  pour Bottom: 0,22.86 50.8,22.86 50.8,0 0,0
MISO  (via drill 0.5)
  Top 0.203: U$3.35 36.83,8.43 36.45,8.05 v36.45,7.86
  Bottom 0.203: v36.45,7.86 36.07,7.48 36.07,2.03 JP1.4
MOSI  (via drill 0.5)
  Top 0.203: U$3.36 35.72,8.93 35.2,8.41 v35.2,7.92
  Bottom 0.203: v35.2,7.92 35.2,7.73 35.65,7.29 35.65,2.63 JP1.5
N$1
  Top 0.305: CHG.C 3.77,5.59 R2.1
N$2
  Top 0.203: L.A 4.56,17.36 R7.2
N$3  (via drill 0.5)
  Top 0.203: v17.02,12.19 17.39,12.56 17.39,12.69 17.91,13.22 U3.1 | v7.49,2.92 6.87,3.54 R2.2
  Bottom 0.203: v17.02,12.19 16.29,12.92 8.72,12.92 6.89,11.08 6.89,9.79 7.11,9.57 7.11,3.3 v7.49,2.92
N$4
  Top 0.203: U3.5 17.91,17.63 R8.1
N$5
  Top 0.203: C2.4 24.09,15.27 X2.P$1 26.03,13.93 U$3.3
N$6
  Top 0.203: Y1.3 23.18,8.9 23.4,9.12 23.4,10.8 22.33,10.8 22.12,11.01 22.12,12.05 22.5,12.43 C2.2 23.14,12.43 23.61,11.95 25.7,11.95 26.67,12.93 U$3.5
N$7
  Top 0.203: C2.3 24.21,13.23 24.75,12.68 24.88,12.68 | 24.88,12.68 X2.P$2 | U$3.4 26.02,13.43 25.13,12.53 25.13,12.81 25,12.68 24.88,12.68
N$8
  Top 0.203: U$3.6 27.67,12.46 26.82,12.46 24.39,10.03 24.31,10.03 Y1.1 24.19,10.92 23.58,11.53 C2.1
RX_D0
  Top 0.203: U$3.30 36.15,4.49 36.7,3.94 38.35,3.94 | 38.35,3.94 39.37,2.92 JP1.3 | 38.35,3.94 38.67,4.25 R10.2
SCK  (via drill 0.5)
  Top 0.203: U$3.34 37.77,7.93 36.88,7.04 33.98,7.04 v33.66,7.37
  Bottom 0.203: v33.66,7.37 33.66,3.17 JP1.6
SCL  (via drill 0.5)
  Top 0.203: R1.2 44.41,9.38 44.91,9.88 CONN1.4 46.75,9.88 v47.71,8.92 | JP3.11 41.91,20.57 41.77,20.43 | 41.77,20.43 45.13,20.43 45.71,19.86 v45.71,19.48 | U$3.58 32.65,17.81 32.19,18.27 32.19,19.68 32.94,20.43 41.77,20.43
  Bottom 0.203: v47.71,8.92 47.87,8.92 48.78,9.83 48.78,15.04 47.1,16.71 47.1,18.01 45.64,19.48 v45.71,19.48
SD_DETECT  (via drill 0.5)
  Top 0.203: v40.37,7.74 40.05,7.43 U$3.33
  Bottom 0.203: X5.CD2 36.16,9.62 37.09,9.62 39.34,7.37 39.99,7.37 v40.37,7.74
SDA  (via drill 0.5)
  Top 0.203: R1.1 44.47,8.48 44.88,8.88 CONN1.3 46.11,8.88 v48.13,6.86 | U$3.59 32.2,16.83 32.2,16.15 32.38,15.97 33.8,15.97 34.28,15.49 v34.28,14.99
  Bottom 0.203: v34.28,14.99 34.28,17.39 36.89,20 39.43,20 39.88,20.45 43.31,20.45 JP3.12 44.81,21.95 49.05,21.95 49.91,21.08 49.91,8.64 v48.13,6.86
SDIO_CLK  (via drill 0.5)
  Top 0.203: U$3.53 35.15,17.51 35.41,17.77 36.26,17.77 36.7,18.21 38.57,18.21 v38.83,17.95
  Bottom 0.203: X5.5 45.12,13.37 44.13,13.37 42.73,11.98 40.59,11.98 39.81,12.76 39.81,15.31 38.82,16.3 38.82,17.94 v38.83,17.95
SDIO_CMD  (via drill 0.5)
  Top 0.203: U$3.54 34.65,17.57 35.22,18.15 36.08,18.15 36.64,18.71 40.35,18.71 v41.02,18.04
  Bottom 0.203: v41.02,18.04 41.27,17.78 46.41,17.78 46.66,17.54 46.66,16.62 48.34,14.94 48.34,13.16 46.74,11.56 45.62,11.56 X5.3
SDIO_D0  (via drill 0.39)
  Top 0.203: U$3.39 40.02,10.43 40.56,10.97 40.56,11.49 42.13,13.06 v42.13,13.24
  Bottom 0.203: v42.13,13.24 42.19,13.3 42.19,14.89 43.31,16.02 X5.7
SDIO_D1  (via drill 0.39)
  Top 0.203: U$3.40 39.88,10.93 40.13,11.18 40.13,12.12 41.08,13.07 v41.08,13.15
  Bottom 0.203: v41.08,13.15 41.08,15.93 42.26,17.11 X5.8
SDIO_D2  (via drill 0.5)
  Top 0.203: v37.05,14.31 37.28,14.54 36.15,15.66 U$3.51
  Bottom 0.203: X5.1 44.61,9.41 43.41,10.62 40.01,10.62 40.01,10.6 38.39,12.22 38.39,13.04 37.12,14.31 v37.05,14.31
SDIO_D3  (via drill 0.5)
  Top 0.203: R1.3 44.22,10.18 44.54,10.5 46.56,10.5 v46.74,10.67 | U$3.52 35.65,15.09 v35.88,14.86
  Bottom 0.203: v46.74,10.67 46.58,10.52 X5.2 44.66,11.02 40.2,11.02 38.83,12.39 38.83,13.74 37.18,15.39 36.55,15.39 36.02,14.86 v35.88,14.86
SWCLK  (via drill 0.39)
  Top 0.203: U$3.49 37.15,15.39 37.18,15.39 37.81,14.75 37.81,13.99 37.09,13.27 35.6,13.27 34.95,12.62 32.41,12.62 v32.34,12.55
  Bottom 0.203: v32.34,12.55 32.34,12.09 TP2.P$1 32.26,11.05 31.23,10.02 31.23,7.89 31.75,7.37 31.75,5.81 29.69,3.75 20.51,3.75 20.13,3.37 16.11,3.37 14.92,4.55 14.92,6.54 14.35,7.11 13.41,7.11 X3.4
SWDIO  (via drill 0.5)
  Top 0.203: U$3.46 39.06,13.88 38.31,13.88 37.27,12.84 35.81,12.84 33.83,10.86 v33.15,10.86
  Bottom 0.203: v33.15,10.86 32.26,9.97 TP1.P$1 32.26,8.57 32.13,8.45 32.13,5.65 29.84,3.37 20.7,3.37 20.32,2.98 15.82,2.98 13.28,5.52 X3.2
TX_D1  (via drill 0.5)
  Top 0.203: v37.97,3.17 37.92,3.12 36.78,3.12 35.65,4.25 U$3.29
  Bottom 0.203: v37.97,3.17 40.89,3.17 41.91,2.16 JP1.2
V_DIV  (via drill 0.5)
  Top 0.203: R9.2 R9.1 22.88,15.14 v22.86,15.11 | U$3.17 29,5.48 v28.83,5.65 27.61,5.65 26.82,4.87 C17.1
  Bottom 0.203: v22.86,15.11 22.86,15.49 23.75,16.38 26.61,16.38 27.18,15.81 27.18,12.31 30.22,9.27 30.22,6.98 28.89,5.65 v28.83,5.65
VBAT
  Top 0.305: C3.1 15.88,17.71 15.88,20.95 JP3.1 | U3.3 19.81,14.66 19.91,14.76 | 19.91,14.76 R9.8 | X1.2 13.71,17.4 C3.1 | C3.1 16.51,17.4 17.28,16.63 17.28,15.67 18.18,14.77 19.28,14.77 19.29,14.76 19.91,14.76
  Top 0.406: X1.2 11.92,13.57 10.67,12.32 10.67,11.18 10.21,10.72 Q3.3
VBUS  (via drill 0.5)
  Top 0.203: 5.7,13.96 5.33,13.59
  Top 0.305: JP3.3 21.97,21.21 21.97,18.16 21.55,17.73 R9.6 20.66,17.73 20.38,17.46 20.38,16.64 20.16,16.41 U3.4 | X6.A4B9 5.7,13.96 | 5.33,13.59 4.83,13.59 4.38,14.03 3.3,14.03 2.48,13.21 2.48,10.16 3.49,9.14 3.49,7.43 1.65,5.59 CHG.A
  Top 0.406: X6.A4B9 6.32,14.06 8.51,14.06 8.51,14.16 | 8.51,14.16 8.95,13.72 8.95,12.88 9.52,12.32 D4.A 8.89,11.57 8.89,8.9 Q3.1 7.37,8.72 6.93,9.16 X6.B4A9 | v12.13,20.64 10.92,19.43 10.03,19.43 8.51,17.91 8.51,14.16
  Bottom 0.406: v12.13,20.64 12.13,20.32 20.7,20.32 21.59,21.21 JP3.3
VCAP1
  Top 0.203: U$3.31 36.65,4.62 36.83,4.45 37.59,4.45 C9.1
VCAP2
  Top 0.203: C12.1 40.73,14.86 40.29,14.43 U$3.47
VHI
  Top 0.305: R3.2 19.22,10.92 17.02,10.92 16.07,9.97
  Top 0.406: D4.C 13.22,10.93 12.71,10.42 | 12.71,10.42 11.95,9.66 C6.1 11.13,9.25 Q3.2 | U2.1 16.07,9.78 | 16.07,9.78 16.07,9.97 | 12.71,10.42 15.43,10.42 16.07,9.78

### Text on the board
tPlace: I2C